# EAGLE schematic untitled (EAGLE 7.7.0)
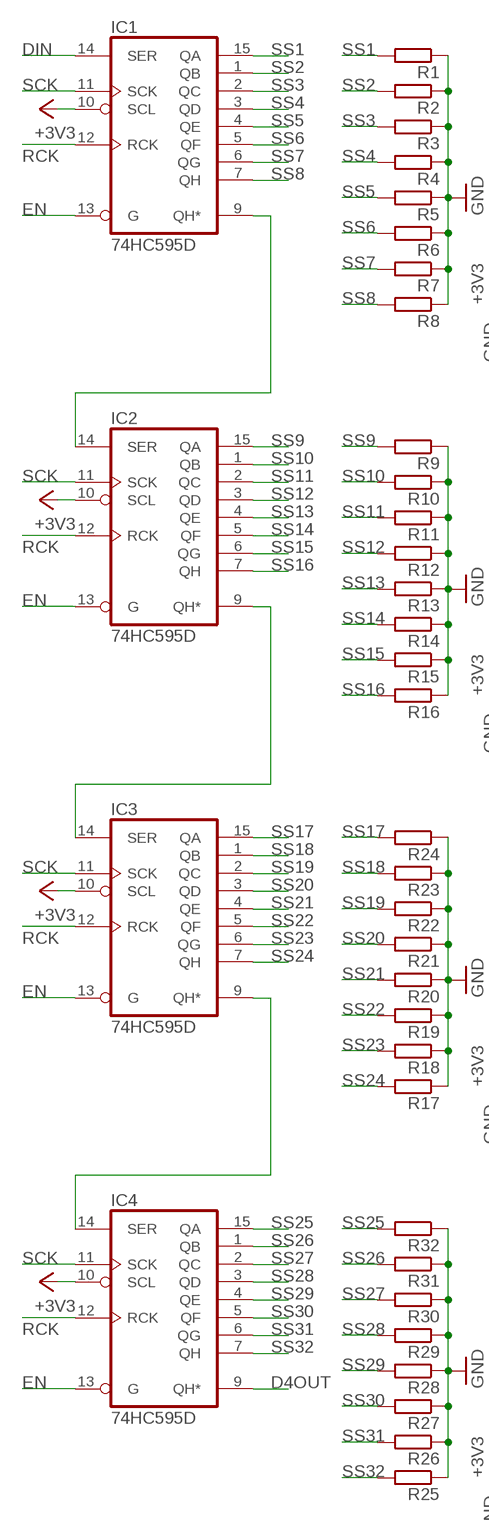
[diagram p0: schematic, sheet 1, part 1 of 2]
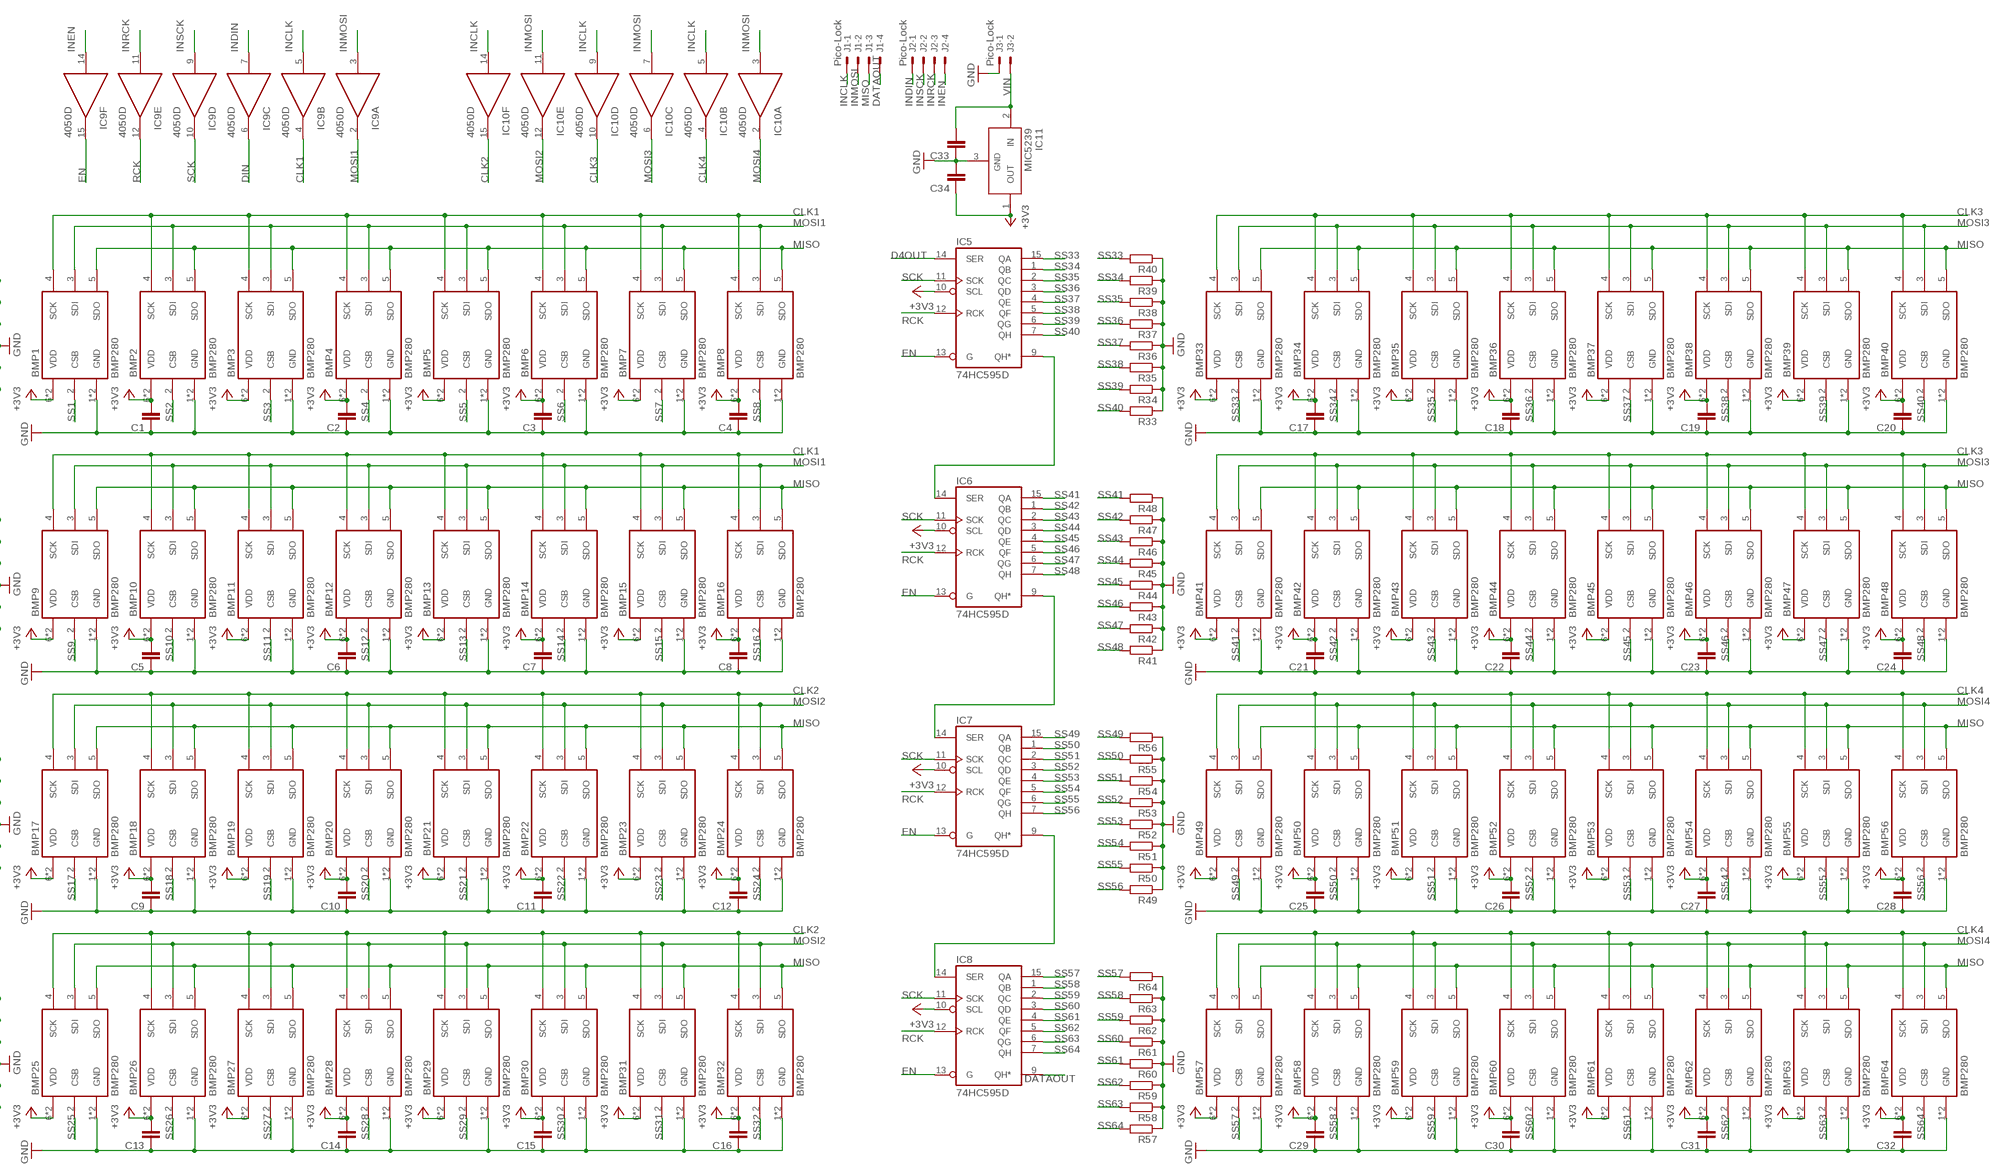
[diagram p1: schematic, sheet 1, part 2 of 2]

## Parts
BMP1  BMP280  [BMP280]
BMP2  BMP280  [BMP280]
BMP3  BMP280  [BMP280]
BMP4  BMP280  [BMP280]
BMP5  BMP280  [BMP280]
BMP6  BMP280  [BMP280]
BMP7  BMP280  [BMP280]
BMP8  BMP280  [BMP280]
BMP9  BMP280  [BMP280]
BMP10  BMP280  [BMP280]
BMP11  BMP280  [BMP280]
BMP12  BMP280  [BMP280]
BMP13  BMP280  [BMP280]
BMP14  BMP280  [BMP280]
BMP15  BMP280  [BMP280]
BMP16  BMP280  [BMP280]
BMP17  BMP280  [BMP280]
BMP18  BMP280  [BMP280]
BMP19  BMP280  [BMP280]
BMP20  BMP280  [BMP280]
BMP21  BMP280  [BMP280]
BMP22  BMP280  [BMP280]
BMP23  BMP280  [BMP280]
BMP24  BMP280  [BMP280]
BMP25  BMP280  [BMP280]
BMP26  BMP280  [BMP280]
BMP27  BMP280  [BMP280]
BMP28  BMP280  [BMP280]
BMP29  BMP280  [BMP280]
BMP30  BMP280  [BMP280]
BMP31  BMP280  [BMP280]
BMP32  BMP280  [BMP280]
BMP33  BMP280  [BMP280]
BMP34  BMP280  [BMP280]
BMP35  BMP280  [BMP280]
BMP36  BMP280  [BMP280]
BMP37  BMP280  [BMP280]
BMP38  BMP280  [BMP280]
BMP39  BMP280  [BMP280]
BMP40  BMP280  [BMP280]
BMP41  BMP280  [BMP280]
BMP42  BMP280  [BMP280]
BMP43  BMP280  [BMP280]
BMP44  BMP280  [BMP280]
BMP45  BMP280  [BMP280]
BMP46  BMP280  [BMP280]
BMP47  BMP280  [BMP280]
BMP48  BMP280  [BMP280]
BMP49  BMP280  [BMP280]
BMP50  BMP280  [BMP280]
BMP51  BMP280  [BMP280]
BMP52  BMP280  [BMP280]
BMP53  BMP280  [BMP280]
BMP54  BMP280  [BMP280]
BMP55  BMP280  [BMP280]
BMP56  BMP280  [BMP280]
BMP57  BMP280  [BMP280]
BMP58  BMP280  [BMP280]
BMP59  BMP280  [BMP280]
BMP60  BMP280  [BMP280]
BMP61  BMP280  [BMP280]
BMP62  BMP280  [BMP280]
BMP63  BMP280  [BMP280]
BMP64  BMP280  [BMP280]
C1  C-EUC0402  [C0402]
C2  C-EUC0402  [C0402]
C3  C-EUC0402  [C0402]
C4  C-EUC0402  [C0402]
C5  C-EUC0402  [C0402]
C6  C-EUC0402  [C0402]
C7  C-EUC0402  [C0402]
C8  C-EUC0402  [C0402]
C9  C-EUC0402  [C0402]
C10  C-EUC0402  [C0402]
C11  C-EUC0402  [C0402]
C12  C-EUC0402  [C0402]
C13  C-EUC0402  [C0402]
C14  C-EUC0402  [C0402]
C15  C-EUC0402  [C0402]
C16  C-EUC0402  [C0402]
C17  C-EUC0402  [C0402]
C18  C-EUC0402  [C0402]
C19  C-EUC0402  [C0402]
C20  C-EUC0402  [C0402]
C21  C-EUC0402  [C0402]
C22  C-EUC0402  [C0402]
C23  C-EUC0402  [C0402]
C24  C-EUC0402  [C0402]
C25  C-EUC0402  [C0402]
C26  C-EUC0402  [C0402]
C27  C-EUC0402  [C0402]
C28  C-EUC0402  [C0402]
C29  C-EUC0402  [C0402]
C30  C-EUC0402  [C0402]
C31  C-EUC0402  [C0402]
C32  C-EUC0402  [C0402]
C33  C-EUC0402  [C0402]
C34  C-EUC0402  [C0402]
IC1  74HC595D  [SO16]
IC2  74HC595D  [SO16]
IC3  74HC595D  [SO16]
IC4  74HC595D  [SO16]
IC5  74HC595D  [SO16]
IC6  74HC595D  [SO16]
IC7  74HC595D  [SO16]
IC8  74HC595D  [SO16]
IC9  4050D  [SO16]
IC10  4050D  [SO16]
IC11  MIC5239  LM3480-3.3  [SOT-23-3]
J1  Pico-Lock  22-23-2041  [22-23-2041]
J2  Pico-Lock  22-23-2041  [22-23-2041]
J3  Pico-Lock  22-23-2021  [22-23-2021]
R1  R-EU_R0402  [R0402]
R2  R-EU_R0402  [R0402]
R3  R-EU_R0402  [R0402]
R4  R-EU_R0402  [R0402]
R5  R-EU_R0402  [R0402]
R6  R-EU_R0603  [R0603]
R7  R-EU_R0402  [R0402]
R8  R-EU_R0402  [R0402]
R9  R-EU_R0402  [R0402]
R10  R-EU_R0402  [R0402]
R11  R-EU_R0402  [R0402]
R12  R-EU_R0402  [R0402]
R13  R-EU_R0402  [R0402]
R14  R-EU_R0402  [R0402]
R15  R-EU_R0402  [R0402]
R16  R-EU_R0402  [R0402]
R17  R-EU_R0402  [R0402]
R18  R-EU_R0402  [R0402]
R19  R-EU_R0402  [R0402]
R20  R-EU_R0402  [R0402]
R21  R-EU_R0402  [R0402]
R22  R-EU_R0402  [R0402]
R23  R-EU_R0402  [R0402]
R24  R-EU_R0402  [R0402]
R25  R-EU_R0402  [R0402]
R26  R-EU_R0402  [R0402]
R27  R-EU_R0402  [R0402]
R28  R-EU_R0402  [R0402]
R29  R-EU_R0402  [R0402]
R30  R-EU_R0402  [R0402]
R31  R-EU_R0402  [R0402]
R32  R-EU_R0402  [R0402]
R33  R-EU_R0402  [R0402]
R34  R-EU_R0402  [R0402]
R35  R-EU_R0402  [R0402]
R36  R-EU_R0402  [R0402]
R37  R-EU_R0402  [R0402]
R38  R-EU_R0402  [R0402]
R39  R-EU_R0402  [R0402]
R40  R-EU_R0402  [R0402]
R41  R-EU_R0402  [R0402]
R42  R-EU_R0402  [R0402]
R43  R-EU_R0402  [R0402]
R44  R-EU_R0402  [R0402]
R45  R-EU_R0402  [R0402]
R46  R-EU_R0402  [R0402]
R47  R-EU_R0402  [R0402]
R48  R-EU_R0402  [R0402]
R49  R-EU_R0402  [R0402]
R50  R-EU_R0402  [R0402]
R51  R-EU_R0402  [R0402]
R52  R-EU_R0402  [R0402]
R53  R-EU_R0402  [R0402]
R54  R-EU_R0402  [R0402]
R55  R-EU_R0402  [R0402]
R56  R-EU_R0402  [R0402]
R57  R-EU_R0402  [R0402]
R58  R-EU_R0402  [R0402]
R59  R-EU_R0402  [R0402]
R60  R-EU_R0402  [R0402]
R61  R-EU_R0402  [R0402]
R62  R-EU_R0402  [R0402]
R63  R-EU_R0402  [R0402]
R64  R-EU_R0402  [R0402]

## Nets
+3V3: BMP1.6(VDD) BMP1.8(VDD) BMP2.6(VDD) BMP2.8(VDD) BMP3.6(VDD) BMP3.8(VDD) BMP4.6(VDD) BMP4.8(VDD) BMP5.6(VDD) BMP5.8(VDD) BMP6.6(VDD) BMP6.8(VDD) BMP7.6(VDD) BMP7.8(VDD) BMP8.6(VDD) BMP8.8(VDD) BMP9.6(VDD) BMP9.8(VDD) BMP10.6(VDD) BMP10.8(VDD) BMP11.6(VDD) BMP11.8(VDD) BMP12.6(VDD) BMP12.8(VDD) BMP13.6(VDD) BMP13.8(VDD) BMP14.6(VDD) BMP14.8(VDD) BMP15.6(VDD) BMP15.8(VDD) BMP16.6(VDD) BMP16.8(VDD) BMP17.6(VDD) BMP17.8(VDD) BMP18.6(VDD) BMP18.8(VDD) BMP19.6(VDD) BMP19.8(VDD) BMP20.6(VDD) BMP20.8(VDD) BMP21.6(VDD) BMP21.8(VDD) BMP22.6(VDD) BMP22.8(VDD) BMP23.6(VDD) BMP23.8(VDD) BMP24.6(VDD) BMP24.8(VDD) BMP25.6(VDD) BMP25.8(VDD) BMP26.6(VDD) BMP26.8(VDD) BMP27.6(VDD) BMP27.8(VDD) BMP28.6(VDD) BMP28.8(VDD) BMP29.6(VDD) BMP29.8(VDD) BMP30.6(VDD) BMP30.8(VDD) BMP31.6(VDD) BMP31.8(VDD) BMP32.6(VDD) BMP32.8(VDD) BMP33.6(VDD) BMP33.8(VDD) BMP34.6(VDD) BMP34.8(VDD) BMP35.6(VDD) BMP35.8(VDD) BMP36.6(VDD) BMP36.8(VDD) BMP37.6(VDD) BMP37.8(VDD) BMP38.6(VDD) BMP38.8(VDD) BMP39.6(VDD) BMP39.8(VDD) BMP40.6(VDD) BMP40.8(VDD) BMP41.6(VDD) BMP41.8(VDD) BMP42.6(VDD) BMP42.8(VDD) BMP43.6(VDD) BMP43.8(VDD) BMP44.6(VDD) BMP44.8(VDD) BMP45.6(VDD) BMP45.8(VDD) BMP46.6(VDD) BMP46.8(VDD) BMP47.6(VDD) BMP47.8(VDD) BMP48.6(VDD) BMP48.8(VDD) BMP49.6(VDD) BMP49.8(VDD) BMP50.6(VDD) BMP50.8(VDD) BMP51.6(VDD) BMP51.8(VDD) BMP52.6(VDD) BMP52.8(VDD) BMP53.6(VDD) BMP53.8(VDD) BMP54.6(VDD) BMP54.8(VDD) BMP55.6(VDD) BMP55.8(VDD) BMP56.6(VDD) BMP56.8(VDD) BMP57.6(VDD) BMP57.8(VDD) BMP58.6(VDD) BMP58.8(VDD) BMP59.6(VDD) BMP59.8(VDD) BMP60.6(VDD) BMP60.8(VDD) BMP61.6(VDD) BMP61.8(VDD) BMP62.6(VDD) BMP62.8(VDD) BMP63.6(VDD) BMP63.8(VDD) BMP64.6(VDD) BMP64.8(VDD) C1.2 C2.2 C3.2 C4.2 C5.2 C6.2 C7.2 C8.2 C9.2 C10.2 C11.2 C12.2 C13.2 C14.2 C15.2 C16.2 C17.2 C18.2 C19.2 C20.2 C21.2 C22.2 C23.2 C24.2 C25.2 C26.2 C27.2 C28.2 C29.2 C30.2 C31.2 C32.2 C34.1 IC1.10(SCL) IC2.10(SCL) IC3.10(SCL) IC4.10(SCL) IC5.10(SCL) IC6.10(SCL) IC7.10(SCL) IC8.10(SCL) IC11.1(OUT)
CLK1: BMP1.4(SCK) BMP2.4(SCK) BMP3.4(SCK) BMP4.4(SCK) BMP5.4(SCK) BMP6.4(SCK) BMP7.4(SCK) BMP8.4(SCK) BMP9.4(SCK) BMP10.4(SCK) BMP11.4(SCK) BMP12.4(SCK) BMP13.4(SCK) BMP14.4(SCK) BMP15.4(SCK) BMP16.4(SCK) IC9.4(B:O)
CLK2: BMP17.4(SCK) BMP18.4(SCK) BMP19.4(SCK) BMP20.4(SCK) BMP21.4(SCK) BMP22.4(SCK) BMP23.4(SCK) BMP24.4(SCK) BMP25.4(SCK) BMP26.4(SCK) BMP27.4(SCK) BMP28.4(SCK) BMP29.4(SCK) BMP30.4(SCK) BMP31.4(SCK) BMP32.4(SCK) IC10.15(F:O)
CLK3: BMP33.4(SCK) BMP34.4(SCK) BMP35.4(SCK) BMP36.4(SCK) BMP37.4(SCK) BMP38.4(SCK) BMP39.4(SCK) BMP40.4(SCK) BMP41.4(SCK) BMP42.4(SCK) BMP43.4(SCK) BMP44.4(SCK) BMP45.4(SCK) BMP46.4(SCK) BMP47.4(SCK) BMP48.4(SCK) IC10.10(D:O)
CLK4: BMP49.4(SCK) BMP50.4(SCK) BMP51.4(SCK) BMP52.4(SCK) BMP53.4(SCK) BMP54.4(SCK) BMP55.4(SCK) BMP56.4(SCK) BMP57.4(SCK) BMP58.4(SCK) BMP59.4(SCK) BMP60.4(SCK) BMP61.4(SCK) BMP62.4(SCK) BMP63.4(SCK) BMP64.4(SCK) IC10.4(B:O)
D4OUT: IC4.9(QH*) IC5.14(SER)
DATAOUT: IC8.9(QH*) J1.4
DIN: IC1.14(SER) IC9.6(C:O)
EN: IC1.13(G) IC2.13(G) IC3.13(G) IC4.13(G) IC5.13(G) IC6.13(G) IC7.13(G) IC8.13(G) IC9.15(F:O)
GND: BMP1.1(GND) BMP1.7(GND) BMP2.1(GND) BMP2.7(GND) BMP3.1(GND) BMP3.7(GND) BMP4.1(GND) BMP4.7(GND) BMP5.1(GND) BMP5.7(GND) BMP6.1(GND) BMP6.7(GND) BMP7.1(GND) BMP7.7(GND) BMP8.1(GND) BMP8.7(GND) BMP9.1(GND) BMP9.7(GND) BMP10.1(GND) BMP10.7(GND) BMP11.1(GND) BMP11.7(GND) BMP12.1(GND) BMP12.7(GND) BMP13.1(GND) BMP13.7(GND) BMP14.1(GND) BMP14.7(GND) BMP15.1(GND) BMP15.7(GND) BMP16.1(GND) BMP16.7(GND) BMP17.1(GND) BMP17.7(GND) BMP18.1(GND) BMP18.7(GND) BMP19.1(GND) BMP19.7(GND) BMP20.1(GND) BMP20.7(GND) BMP21.1(GND) BMP21.7(GND) BMP22.1(GND) BMP22.7(GND) BMP23.1(GND) BMP23.7(GND) BMP24.1(GND) BMP24.7(GND) BMP25.1(GND) BMP25.7(GND) BMP26.1(GND) BMP26.7(GND) BMP27.1(GND) BMP27.7(GND) BMP28.1(GND) BMP28.7(GND) BMP29.1(GND) BMP29.7(GND) BMP30.1(GND) BMP30.7(GND) BMP31.1(GND) BMP31.7(GND) BMP32.1(GND) BMP32.7(GND) BMP33.1(GND) BMP33.7(GND) BMP34.1(GND) BMP34.7(GND) BMP35.1(GND) BMP35.7(GND) BMP36.1(GND) BMP36.7(GND) BMP37.1(GND) BMP37.7(GND) BMP38.1(GND) BMP38.7(GND) BMP39.1(GND) BMP39.7(GND) BMP40.1(GND) BMP40.7(GND) BMP41.1(GND) BMP41.7(GND) BMP42.1(GND) BMP42.7(GND) BMP43.1(GND) BMP43.7(GND) BMP44.1(GND) BMP44.7(GND) BMP45.1(GND) BMP45.7(GND) BMP46.1(GND) BMP46.7(GND) BMP47.1(GND) BMP47.7(GND) BMP48.1(GND) BMP48.7(GND) BMP49.1(GND) BMP49.7(GND) BMP50.1(GND) BMP50.7(GND) BMP51.1(GND) BMP51.7(GND) BMP52.1(GND) BMP52.7(GND) BMP53.1(GND) BMP53.7(GND) BMP54.1(GND) BMP54.7(GND) BMP55.1(GND) BMP55.7(GND) BMP56.1(GND) BMP56.7(GND) BMP57.1(GND) BMP57.7(GND) BMP58.1(GND) BMP58.7(GND) BMP59.1(GND) BMP59.7(GND) BMP60.1(GND) BMP60.7(GND) BMP61.1(GND) BMP61.7(GND) BMP62.1(GND) BMP62.7(GND) BMP63.1(GND) BMP63.7(GND) BMP64.1(GND) BMP64.7(GND) C1.1 C2.1 C3.1 C4.1 C5.1 C6.1 C7.1 C8.1 C9.1 C10.1 C11.1 C12.1 C13.1 C14.1 C15.1 C16.1 C17.1 C18.1 C19.1 C20.1 C21.1 C22.1 C23.1 C24.1 C25.1 C26.1 C27.1 C28.1 C29.1 C30.1 C31.1 C32.1 C33.1 C34.2 IC11.3(GND) J3.1 R1.1 R2.1 R3.1 R4.1 R5.1 R6.1 R7.1 R8.1 R9.1 R10.1 R11.1 R12.1 R13.1 R14.1 R15.1 R16.1 R17.1 R18.1 R19.1 R20.1 R21.1 R22.1 R23.1 R24.1 R25.1 R26.1 R27.1 R28.1 R29.1 R30.1 R31.1 R32.1 R33.1 R34.1 R35.1 R36.1 R37.1 R38.1 R39.1 R40.1 R41.1 R42.1 R43.1 R44.1 R45.1 R46.1 R47.1 R48.1 R49.1 R50.1 R51.1 R52.1 R53.1 R54.1 R55.1 R56.1 R57.1 R58.1 R59.1 R60.1 R61.1 R62.1 R63.1 R64.1
INCLK: IC9.5(B:I) IC10.5(B:I) IC10.9(D:I) IC10.14(F:I) J1.1
INDIN: IC9.7(C:I) J2.1
INEN: IC9.14(F:I) J2.4
INMOSI: IC9.3(A:I) IC10.3(A:I) IC10.7(C:I) IC10.11(E:I) J1.2
INRCK: IC9.11(E:I) J2.3
INSCK: IC9.9(D:I) J2.2
MISO: BMP2.5(SDO) BMP3.5(SDO) BMP4.5(SDO) BMP5.5(SDO) BMP6.5(SDO) BMP7.5(SDO) BMP8.5(SDO) BMP10.5(SDO) BMP11.5(SDO) BMP12.5(SDO) BMP13.5(SDO) BMP14.5(SDO) BMP15.5(SDO) BMP16.5(SDO) BMP18.5(SDO) BMP19.5(SDO) BMP20.5(SDO) BMP21.5(SDO) BMP22.5(SDO) BMP23.5(SDO) BMP24.5(SDO) BMP26.5(SDO) BMP27.5(SDO) BMP28.5(SDO) BMP29.5(SDO) BMP30.5(SDO) BMP31.5(SDO) BMP32.5(SDO) BMP34.5(SDO) BMP35.5(SDO) BMP36.5(SDO) BMP37.5(SDO) BMP38.5(SDO) BMP39.5(SDO) BMP40.5(SDO) BMP42.5(SDO) BMP43.5(SDO) BMP44.5(SDO) BMP45.5(SDO) BMP46.5(SDO) BMP47.5(SDO) BMP48.5(SDO) BMP50.5(SDO) BMP51.5(SDO) BMP52.5(SDO) BMP53.5(SDO) BMP54.5(SDO) BMP55.5(SDO) BMP56.5(SDO) BMP58.5(SDO) BMP59.5(SDO) BMP60.5(SDO) BMP61.5(SDO) BMP62.5(SDO) BMP63.5(SDO) BMP64.5(SDO) J1.3
MOSI1: BMP1.3(SDI) BMP2.3(SDI) BMP3.3(SDI) BMP4.3(SDI) BMP5.3(SDI) BMP6.3(SDI) BMP7.3(SDI) BMP8.3(SDI) BMP9.3(SDI) BMP10.3(SDI) BMP11.3(SDI) BMP12.3(SDI) BMP13.3(SDI) BMP14.3(SDI) BMP15.3(SDI) BMP16.3(SDI) IC9.2(A:O)
MOSI2: BMP17.3(SDI) BMP18.3(SDI) BMP19.3(SDI) BMP20.3(SDI) BMP21.3(SDI) BMP22.3(SDI) BMP23.3(SDI) BMP24.3(SDI) BMP25.3(SDI) BMP26.3(SDI) BMP27.3(SDI) BMP28.3(SDI) BMP29.3(SDI) BMP30.3(SDI) BMP31.3(SDI) BMP32.3(SDI) IC10.12(E:O)
MOSI3: BMP33.3(SDI) BMP34.3(SDI) BMP35.3(SDI) BMP36.3(SDI) BMP37.3(SDI) BMP38.3(SDI) BMP39.3(SDI) BMP40.3(SDI) BMP41.3(SDI) BMP42.3(SDI) BMP43.3(SDI) BMP44.3(SDI) BMP45.3(SDI) BMP46.3(SDI) BMP47.3(SDI) BMP48.3(SDI) IC10.6(C:O)
MOSI4: BMP49.3(SDI) BMP50.3(SDI) BMP51.3(SDI) BMP52.3(SDI) BMP53.3(SDI) BMP54.3(SDI) BMP55.3(SDI) BMP56.3(SDI) BMP57.3(SDI) BMP58.3(SDI) BMP59.3(SDI) BMP60.3(SDI) BMP61.3(SDI) BMP62.3(SDI) BMP63.3(SDI) BMP64.3(SDI) IC10.2(A:O)
N$3: IC1.9(QH*) IC2.14(SER)
N$7: IC2.9(QH*) IC3.14(SER)
N$17: BMP17.5(SDO)
N$21: BMP9.5(SDO)
N$28: BMP25.5(SDO)
N$29: IC3.9(QH*) IC4.14(SER)
N$36: BMP1.5(SDO)
N$40: BMP33.5(SDO)
N$47: BMP41.5(SDO)
N$48: IC5.9(QH*) IC6.14(SER)
N$55: BMP49.5(SDO)
N$62: BMP57.5(SDO)
N$63: IC7.9(QH*) IC8.14(SER)
N$64: IC6.9(QH*) IC7.14(SER)
RCK: IC1.12(RCK) IC2.12(RCK) IC3.12(RCK) IC4.12(RCK) IC5.12(RCK) IC6.12(RCK) IC7.12(RCK) IC8.12(RCK) IC9.12(E:O)
SCK: IC1.11(SCK) IC2.11(SCK) IC3.11(SCK) IC4.11(SCK) IC5.11(SCK) IC6.11(SCK) IC7.11(SCK) IC8.11(SCK) IC9.10(D:O)
SS1: BMP1.2(CSB) IC1.15(QA) R1.2
SS2: BMP2.2(CSB) IC1.1(QB) R2.2
SS3: BMP3.2(CSB) IC1.2(QC) R3.2
SS4: BMP4.2(CSB) IC1.3(QD) R4.2
SS5: BMP5.2(CSB) IC1.4(QE) R5.2
SS6: BMP6.2(CSB) IC1.5(QF) R6.2
SS7: BMP7.2(CSB) IC1.6(QG) R7.2
SS8: BMP8.2(CSB) IC1.7(QH) R8.2
SS9: BMP9.2(CSB) IC2.15(QA) R9.2
SS10: BMP10.2(CSB) IC2.1(QB) R10.2
SS11: BMP11.2(CSB) IC2.2(QC) R11.2
SS12: BMP12.2(CSB) IC2.3(QD) R12.2
SS13: BMP13.2(CSB) IC2.4(QE) R13.2
SS14: BMP14.2(CSB) IC2.5(QF) R14.2
SS15: BMP15.2(CSB) IC2.6(QG) R15.2
SS16: BMP16.2(CSB) IC2.7(QH) R16.2
SS17: BMP17.2(CSB) IC3.15(QA) R24.2
SS18: BMP18.2(CSB) IC3.1(QB) R23.2
SS19: BMP19.2(CSB) IC3.2(QC) R22.2
SS20: BMP20.2(CSB) IC3.3(QD) R21.2
SS21: BMP21.2(CSB) IC3.4(QE) R20.2
SS22: BMP22.2(CSB) IC3.5(QF) R19.2
SS23: BMP23.2(CSB) IC3.6(QG) R18.2
SS24: BMP24.2(CSB) IC3.7(QH) R17.2
SS25: BMP25.2(CSB) IC4.15(QA) R32.2
SS26: BMP26.2(CSB) IC4.1(QB) R31.2
SS27: BMP27.2(CSB) IC4.2(QC) R30.2
SS28: BMP28.2(CSB) IC4.3(QD) R29.2
SS29: BMP29.2(CSB) IC4.4(QE) R28.2
SS30: BMP30.2(CSB) IC4.5(QF) R27.2
SS31: BMP31.2(CSB) IC4.6(QG) R26.2
SS32: BMP32.2(CSB) IC4.7(QH) R25.2
SS33: BMP33.2(CSB) IC5.15(QA) R40.2
SS34: BMP34.2(CSB) IC5.1(QB) R39.2
SS35: BMP35.2(CSB) IC5.2(QC) R38.2
SS36: BMP36.2(CSB) IC5.3(QD) R37.2
SS37: BMP37.2(CSB) IC5.4(QE) R36.2
SS38: BMP38.2(CSB) IC5.5(QF) R35.2
SS39: BMP39.2(CSB) IC5.6(QG) R34.2
SS40: BMP40.2(CSB) IC5.7(QH) R33.2
SS41: BMP41.2(CSB) IC6.15(QA) R48.2
SS42: BMP42.2(CSB) IC6.1(QB) R47.2
SS43: BMP43.2(CSB) IC6.2(QC) R46.2
SS44: BMP44.2(CSB) IC6.3(QD) R45.2
SS45: BMP45.2(CSB) IC6.4(QE) R44.2
SS46: BMP46.2(CSB) IC6.5(QF) R43.2
SS47: BMP47.2(CSB) IC6.6(QG) R42.2
SS48: BMP48.2(CSB) IC6.7(QH) R41.2
SS49: BMP49.2(CSB) IC7.15(QA) R56.2
SS50: BMP50.2(CSB) IC7.1(QB) R55.2
SS51: BMP51.2(CSB) IC7.2(QC) R54.2
SS52: BMP52.2(CSB) IC7.3(QD) R53.2
SS53: BMP53.2(CSB) IC7.4(QE) R52.2
SS54: BMP54.2(CSB) IC7.5(QF) R51.2
SS55: BMP55.2(CSB) IC7.6(QG) R50.2
SS56: BMP56.2(CSB) IC7.7(QH) R49.2
SS57: BMP57.2(CSB) IC8.15(QA) R64.2
SS58: BMP58.2(CSB) IC8.1(QB) R63.2
SS59: BMP59.2(CSB) IC8.2(QC) R62.2
SS60: BMP60.2(CSB) IC8.3(QD) R61.2
SS61: BMP61.2(CSB) IC8.4(QE) R60.2
SS62: BMP62.2(CSB) IC8.5(QF) R59.2
SS63: BMP63.2(CSB) IC8.6(QG) R58.2
SS64: BMP64.2(CSB) IC8.7(QH) R57.2
VIN: C33.2 IC11.2(IN) J3.2

## Power pins joined to a net without a drawn wire
GND: IC1.8(GND) IC2.8(GND) IC3.8(GND) IC4.8(GND) IC5.8(GND) IC6.8(GND) IC7.8(GND) IC8.8(GND)
VCC: IC1.16(VCC) IC2.16(VCC) IC3.16(VCC) IC4.16(VCC) IC5.16(VCC) IC6.16(VCC) IC7.16(VCC) IC8.16(VCC)
VDD: IC9.1(P:VDD) IC10.1(P:VDD)
VSS: IC9.8(P:VSS) IC10.8(P:VSS)

## Library data of the parts
BMP1-BMP64 = bosch-bmp280:BMP280: The BMP280 is an absolute barometric pressure sensor especially designed for mobile applications. The sensor module is housed in an extremely compact 8-pin metal-lid LGA package with a footprint of only 2.0 × 2.5 mm2 and 0.95 mm package height. Its small dimensions and its low power consumption of 2.7 μA @1Hz allow the implementation in battery driven devices such as mobile phones, GPS modules or watches. The library has been designed by Richard Magdycz <https://www.facebook.com/groups/eaglecadsoftUK>
C1-C34 = resistor:C-EU: CAPACITOR, European symbol
IC1-IC8 = 74xx-eu:74*595: 8-bit SHIFT REGISTER, output latch
IC9 IC10 = 40xx:4050: Hex non-inverting BUFFER
IC11 = regulators:LM3480-*: National Semiconductor LM3480 100 mA, SOT-23, quasi-LDO linear regulator
J1 J2 = con-molex:22-23-2041: .100" (2.54mm) Center Header - 4 Pin; MF: MOLEX; MPN: 22-23-2041; OC_FARNELL: 1462920; OC_NEWARK: 38C0355
J3 = con-molex:22-23-2021: .100" (2.54mm) Center Header - 2 Pin; MF: MOLEX; MPN: 22-23-2021; OC_FARNELL: 1462926; OC_NEWARK: 25C3832
R1-R64 = resistor:R-EU_: RESISTOR, European symbol